# Altium schematic sheet Power Supply.SchDoc: Dual Feeder -
size Letter; DrawnBy: Mark Harris; Engineer: Mark Harris; Organization: Mark Harris; ProjectName: Dual Feeder Controller
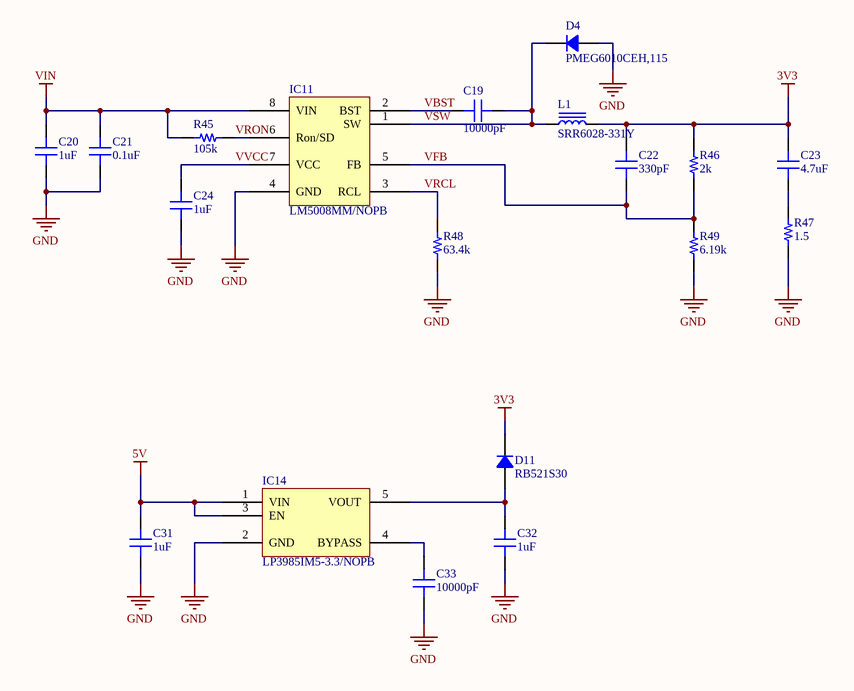
[diagram p0: Power Supply.SchDoc]

## Parts
C19  10000pF  [CAP 0603/1608]
C20  1uF  [CAP 0603/1608]
C21  0.1uF  [CAP 0603/1608]
C22  330pF  [CAP 0603/1608]
C23  4.7uF  [CAP 0603/1608]
C24  1uF  [CAP 0603/1608]
C31  1uF  [CAP 0603/1608]
C32  1uF  [CAP 0603/1608]
C33  10000pF  [CAP 0603/1608]
D4  PMEG6010CEH,115  [SOD123F]
D11  RB521S30  [SOD523F]
IC11  LM5008MM/NOPB  [TI VSSOP-8 DGK]
IC14  LP3985IM5-3.3/NOPB  [TI SOT-23-5 DBV]
L1  SRR6028-331Y  [BOURNS SRR6028]
R45  105k  [RES 0603/1608]
R46  2k  [RES 0603/1608]
R47  1.5  [RES 0603/1608]
R48  63.4k  [RES 0603/1608]
R49  6.19k  [RES 0603/1608]

## Nets
3V3: C22.2 C23.2 D11.2 L1.2 R46.1
5V: C31.2 IC14.1(VIN) IC14.3(EN)
GND: C20.1 C21.2 C24.1 C31.1 C32.1 C33.1 D4.1 IC11.4(GND) IC14.2(GND) R47.1 R48.1 R49.1
VIN: C20.2 C21.1 IC11.8(VIN) R45.1
VBST: C19.2 IC11.2(BST)
VFB: C22.1 IC11.5(FB) R46.2 R49.2
VRCL: IC11.3(RCL) R48.2
VRON: IC11.6(Ron/SD) R45.2
VSW: C19.1 D4.2 IC11.1(SW) L1.1
VVCC: C24.2 IC11.7(VCC)
NetC23_1: C23.1 R47.2
NetC32_2: C32.2 D11.1 IC14.5(VOUT)
NetC33_2: C33.2 IC14.4(BYPASS)

## Notes on the sheet
- Title
- Size:
- Date:
- Letter
- Number:
- Time:
- Revision:
- Sheet
- of
- File:

## Library data of the parts
C19 C33 = CL10B103KB8NCNC: CAP CER 10000PF 50V X7R 0603; Manufacturer: Samsung Electro-Mechanics America, Inc.; TemperatureRange: -55C ~ 125C; Tolerance: 10%; Value: 10000pF; Part Number: CL10B103KB8NCNC; PartId: 13008; Supplier 1: Digi-Key; Supplier Part Number 1: 1276-1921-2-ND; ComponentLink1Description: Datasheet; ComponentLink1URL: http://www.samsungsem.com/kr/support/library/product-catalog/__icsFiles/afieldfile/2015/11/18/MLCC.pdf; ComponentLink2Description: Digi-Key Listing; ComponentLink2URL: https://www.digikey.com/product-detail/en/samsung-electro-mechanics-america-inc/CL10B103KB8NCNC/1276-1921-2-ND/3887579; TemperatureCoefficient: X7R; Voltage: 50V; Price: 0.0032; Device Package: 0603 (1608 Metric)
C20 C24 C31 C32 = CL10A105KB8NNNC: CAP CER 1UF 50V X5R 0603; Manufacturer: Samsung Electro-Mechanics America, Inc.; TemperatureRange: -55C ~ 85C; Tolerance: 10%; Value: 1uF; Part Number: CL10A105KB8NNNC; PartId: 13187; Supplier 1: Digi-Key; Supplier Part Number 1: 1276-1860-2-ND; ComponentLink1Description: Datasheet; ComponentLink1URL: http://www.samsungsem.com/kr/support/product-search/mlcc/CL10A105KB8NNNC.jsp; ComponentLink2Description: Digi-Key Listing; ComponentLink2URL: https://www.digikey.com/product-detail/en/samsung-electro-mechanics-america-inc/CL10A105KB8NNNC/1276-1860-2-ND/3887518; TemperatureCoefficient: X5R; Voltage: 50V; Price: 0.0236; Device Package: 0603 (1608 Metric)
C21 = CL10B104JB8NNNC: CAP CER 0.1UF 50V X7R 0603; Manufacturer: Samsung Electro-Mechanics America, Inc.; TemperatureRange: -55C ~ 125C; Tolerance: 5%; Value: 0.1uF; Part Number: CL10B104JB8NNNC; PartId: 5416; Supplier 1: Digi-Key; Supplier Part Number 1: 1276-1033-2-ND; ComponentLink1Description: Datasheet; ComponentLink1URL: http://www.samsungsem.com/kr/support/product-search/mlcc/CL10B104JB8NNNC.jsp; ComponentLink2Description: Digi-Key listing; ComponentLink2URL: http://digikey.com/product-detail/en/CL10B104JB8NNNC/1276-1033-2-ND/3886691; TemperatureCoefficient: X7R; Voltage: 50V; Price: 0.0132; Type: -; Device Package: 0603 (1608 Metric)
C22 = C0603C331J5GACTU: CAP CER 330PF 50V NP0 0603; Manufacturer: Kemet; TemperatureRange: -55C ~ 125C; TemperatureCoefficient: C0G, NP0; Tolerance: 5%; Value: 330pF; Part Number: C0603C331J5GACTU; PartId: 13118; Supplier 1: Digi-Key; Supplier Part Number 1: 399-1068-2-ND; ComponentLink1Description: Datasheet; ComponentLink1URL: http://www.kemet.com/docfinder?Partnumber=C0603C331J5GACTU; ComponentLink2Description: Digi-Key Listing; ComponentLink2URL: https://www.digikey.com/product-detail/en/kemet/C0603C331J5GACTU/399-1068-2-ND/411070; Voltage: 50V; Price: 0.0085; Device Package: 0603 (1608 Metric)
C23 = CL10A475KQ8NNNC: CAP CER 4.7UF 6.3V X5R 0603; Manufacturer: Samsung Electro-Mechanics America, Inc.; TemperatureRange: -55C ~ 85C; Tolerance: 10%; Value: 4.7uF; Part Number: CL10A475KQ8NNNC; PartId: 13295; Supplier 1: Digi-Key; Supplier Part Number 1: 1276-1045-2-ND; ComponentLink1Description: Datasheet; ComponentLink1URL: http://www.samsungsem.com/kr/support/product-search/mlcc/CL10A475KQ8NNNC.jsp; ComponentLink2Description: Digi-Key Listing; ComponentLink2URL: https://www.digikey.com/product-detail/en/samsung-electro-mechanics-america-inc/CL10A475KQ8NNNC/1276-1045-2-ND/3886703; TemperatureCoefficient: X5R; Voltage: 6.3V; Price: 0.0144; Device Package: 0603 (1608 Metric)
D4 = PMEG6010CEH,115: DIODE SCHOTTKY 60V 1A SOD123F; Manufacturer: NXP USA Inc.; Current Reverse Leakage @ Vr: 50uA @ 60V; Current Rectified: 1A (DC); Voltage Forward (Vf): 660mV @ 1A; Part Number: PMEG6010CEH,115; PartId: 29169; Supplier 1: Digi-Key; Supplier Part Number 1: 568-4104-1-ND; ComponentLink1Description: Datasheet; ComponentLink1URL: http://www.nxp.com/documents/data_sheet/PMEG6010CEH_PMEG6010CEJ.pdf; ComponentLink2Description: Digi-Key Listing; ComponentLink2URL: https://www.digikey.com/product-detail/en/nxp-usa-inc/PMEG6010CEH,115/568-4104-1-ND/1589917; Junction Operating Temperature: 150C (Max); Price: 0.38; Type: Schottky; Device Package: SOD-123F; Voltage DC Reverse (Vr): 60V
D11 = RB521S30: DIODE SCHOTTKY 30V 200MA SOD523F; Manufacturer: Fairchild Semiconductor; Type: Surface Mount; Current Reverse Leakage @ Vr: 30uA @ 10V; Voltage Forward (Vf): 500mV @ 200mA; Part Number: RB521S30; PartId: 7144; Supplier 1: Digi-Key; Supplier Part Number 1: RB521S30TR-ND; ComponentLink1Description: Datasheet; ComponentLink1URL: http://www.fairchildsemi.com/datasheets/RB/RB521S30.pdf; ComponentLink2Description: Digi-Key Listing; ComponentLink2URL: http://www.digikey.ca/product-detail/en/RB521S30/RB521S30TR-ND/1955135; Junction Operating Temperature: -55C ~ 125C; Price: 0.0455; Device Package: SC-79, SOD-523F; Reverse Recovery Time (trr): -; Voltage DC Reverse (Vr): 30V; Current Rectified: 200mA
IC11 = LM5008MM/NOPB: IC REG BUCK ADJ 0.35A 8VSSOP; Manufacturer: Texas Instruments; Function: Step-Down; Output Configuration: Positive; Output Type: Adjustable; Number Of Outputs: 1; Voltage - Input (Min): 9.5V; Voltage - Input (Max): 95V; Voltage - Output (Min/Fixed): 2.5V; Voltage - Output (Max): 75V; Current Output: 350mA; Frequency - Switching: 50kHz ~ 600kHz; Synchronous Rectifier: No; Part Number: LM5008MM/NOPB; PartId: 27912; Supplier 1: Digi-Key; Supplier Part Number 1: LM5008MM/NOPBCT-ND; ComponentLink1Description: Datasheet; ComponentLink1URL: http://www.ti.com/lit/ds/symlink/lm5008.pdf; ComponentLink2Description: Digi-Key Listing; ComponentLink2URL: https://www.digikey.com/product-detail/en/texas-instruments/LM5008MM-NOPB/LM5008MM-NOPBCT-ND/665720; Device Package: 8-TSSOP, 8-MSOP (0.118", 3.00mm Width); Price: 2.83; Series: -; Operating Temperature: -40C ~ 125C (TJ); Topology: Buck
IC14 = LP3985IM5-3.3/NOPB: IC REG LDO 3.3V 0.15A SOT23-5; Manufacturer: Texas Instruments; Topology: Positive Fixed; Voltage Dropout: 0.06V @ 150mA; Voltage - Input: Up to 6V; Current - Limit (Min): 300mA; Part Number: LP3985IM5-3.3/NOPB; PartId: 7942; Supplier 1: Digi-Key; Supplier Part Number 1: LP3985IM5-3.3/NOPBTR-ND; ComponentLink1Description: Datasheet; ComponentLink1URL: http://www.ti.com/lit/ds/symlink/lp3985.pdf; ComponentLink2Description: Digi-Key Listing; ComponentLink2URL: http://www.digikey.ca/product-detail/en/LP3985IM5-3.3%2FNOPB/LP3985IM5-3.3%2FNOPBTR-ND/440984; Price: 0.2855; Device Package: SC-74A, SOT-753; Voltage - Output: 3.3V; Operating Temperature: -40C ~ 125C
L1 = SRR6028-331Y: FIXED IND 330UH 370MA 1.4 OHM; Manufacturer: Bourns Inc.; Type: Wirewound; Material - Core: Ferrite; Tolerance: 30%; Current - Saturation: 270mA; Shielding: Shielded; DC Resistance (DCR): 1.4 Ohm Max; Q @ Freq: 11 @ 796kHz; Frequency - Self Resonant: 10MHz; Value: 330uH; Part Number: SRR6028-331Y; PartId: 27921; Supplier 1: Digi-Key; Supplier Part Number 1: SRR6028-331YCT-ND; ComponentLink1Description: Datasheet; ComponentLink1URL: http://www.bourns.com/docs/Product-Datasheets/SRR6028.pdf; ComponentLink2Description: Digi-Key Listing; ComponentLink2URL: https://www.digikey.com/product-detail/en/bourns-inc/SRR6028-331Y/SRR6028-331YCT-ND/3767853; Price: 0.68; Device Package: Nonstandard; Series: SRR6028; Inductance: 330uH; Current Rating: 370mA; Operating Temperature: -40C ~ 125C
R45 = ERJ-3EKF1053V: RES SMD 105K OHM 1% 1/10W 0603; Manufacturer: Panasonic Electronic Components; TemperatureRange: -55C ~ 155C; TemperatureCoefficient: 100ppm/C; PowerRating: 0.1W, 1/10W; Value: 105k; Part Number: ERJ-3EKF1053V; PartId: 1243; Supplier 1: Digi-Key; Supplier Part Number 1: P105KHTR-ND; ComponentLink1Description: Datasheet; ComponentLink1URL: http://industrial.panasonic.com/www-cgi/jvcr13pz.cgi?E+PZ+3+AOA0002+ERJ3EKF1053V+7+WW; ComponentLink2Description: Digi-Key listing; ComponentLink2URL: http://digikey.com/product-detail/en/ERJ-3EKF1053V/P105KHTR-ND/196079; Tolerance: 1%; Price: 0.0038; Type: Thick Film; Device Package: 0603 (1608 Metric)
R46 = ERJ-3GEYJ202V: RES SMD 2K OHM 5% 1/10W 0603; Manufacturer: Panasonic Electronic Components; TemperatureRange: -55C ~ 155C; TemperatureCoefficient: 200ppm/C; PowerRating: 0.1W, 1/10W; Value: 2k; Part Number: ERJ-3GEYJ202V; PartId: 11229; Supplier 1: Digi-Key; Supplier Part Number 1: P2.0KGTR-ND; ComponentLink1Description: Datasheet; ComponentLink1URL: http://industrial.panasonic.com/www-cgi/jvcr13pz.cgi?E+PZ+3+AOA0001+ERJ3GEYJ202V+7+WW; ComponentLink2Description: Digi-Key Listing; ComponentLink2URL: https://www.digikey.com/product-detail/en/panasonic-electronic-components/ERJ-3GEYJ202V/P2.0KGTR-ND/104349; Tolerance: 5%; Price: 0.002; Device Package: 0603 (1608 Metric)
R47 = ERJ-3GEYJ1R5V: RES SMD 1.5 OHM 5% 1/10W 0603; Manufacturer: Panasonic Electronic Components; TemperatureRange: -55C ~ 155C; TemperatureCoefficient: -100/ +600ppm/C; PowerRating: 0.1W, 1/10W; Value: 1.5; Part Number: ERJ-3GEYJ1R5V; PartId: 11303; Supplier 1: Digi-Key; Supplier Part Number 1: P1.5GTR-ND; ComponentLink1Description: Datasheet; ComponentLink1URL: http://industrial.panasonic.com/www-cgi/jvcr13pz.cgi?E+PZ+3+AOA0001+ERJ3GEYJ1R5V+7+WW; ComponentLink2Description: Digi-Key Listing; ComponentLink2URL: https://www.digikey.com/product-detail/en/panasonic-electronic-components/ERJ-3GEYJ1R5V/P1.5GTR-ND/282115; Tolerance: 5%; Price: 0.002; Device Package: 0603 (1608 Metric)
R48 = ERJ-3EKF6342V: RES SMD 63.4K OHM 1% 1/10W 0603; Manufacturer: Panasonic Electronic Components; TemperatureRange: -55C ~ 155C; TemperatureCoefficient: 100ppm/C; PowerRating: 0.1W, 1/10W; Value: 63.4k; Part Number: ERJ-3EKF6342V; PartId: 1233; Supplier 1: Digi-Key; Supplier Part Number 1: P63.4KHTR-ND; ComponentLink1Description: Datasheet; ComponentLink1URL: http://industrial.panasonic.com/www-cgi/jvcr13pz.cgi?E+PZ+3+AOA0002+ERJ3EKF6342V+7+WW; ComponentLink2Description: Digi-Key listing; ComponentLink2URL: http://digikey.com/product-detail/en/ERJ-3EKF6342V/P63.4KHTR-ND/196435; Tolerance: 1%; Price: 0.0038; Type: Thick Film; Device Package: 0603 (1608 Metric)
R49 = ERJ-3EKF6191V: RES SMD 6.19K OHM 1% 1/10W 0603; Manufacturer: Panasonic Electronic Components; TemperatureRange: -55C ~ 155C; TemperatureCoefficient: 100ppm/C; PowerRating: 0.1W, 1/10W; Value: 6.19k; Part Number: ERJ-3EKF6191V; PartId: 1083; Supplier 1: Digi-Key; Supplier Part Number 1: P6.19KHTR-ND; ComponentLink1Description: Datasheet; ComponentLink1URL: http://industrial.panasonic.com/www-cgi/jvcr13pz.cgi?E+PZ+3+AOA0002+ERJ3EKF6191V+7+WW; ComponentLink2Description: Digi-Key listing; ComponentLink2URL: http://digikey.com/product-detail/en/ERJ-3EKF6191V/P6.19KHTR-ND/196419; Tolerance: 1%; Price: 0.0038; Type: Thick Film; Device Package: 0603 (1608 Metric)